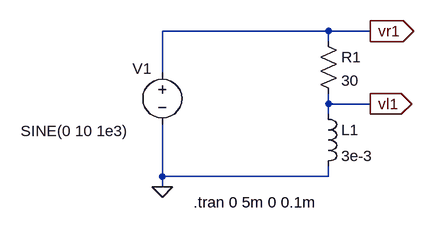
[diagram p0: schematic hw1p1.asc]
hw1p1.asc, the LTspice schematic file:
Version 4
SHEET 1 880 680
WIRE 368 32 112 32
WIRE 432 32 368 32
WIRE 368 48 368 32
WIRE 112 96 112 32
WIRE 368 144 368 128
WIRE 432 144 368 144
WIRE 368 160 368 144
WIRE 112 256 112 176
WIRE 368 256 368 240
WIRE 368 256 112 256
WIRE 112 272 112 256
FLAG 112 272 0
FLAG 432 32 vr1
IOPIN 432 32 Out
FLAG 432 144 vl1
IOPIN 432 144 Out
SYMBOL voltage 112 80 R0
WINDOW 0 -46 10 Left 2
WINDOW 3 -218 106 Left 2
WINDOW 123 0 0 Left 2
WINDOW 39 0 0 Left 2
SYMATTR InstName V1
SYMATTR Value SINE(0 10 1e3)
SYMBOL res 352 32 R0
SYMATTR InstName R1
SYMATTR Value 30
SYMBOL ind 352 144 R0
SYMATTR InstName L1
SYMATTR Value 3e-3
TEXT 160 296 Left 2 !.tran 0 5m 0 0.1m

The netlist it stands for:
* hw1p1.asc
V1 vr1 0 SINE(0 10 1e3)
R1 vr1 vl1 30
L1 vl1 0 3e-3
.tran 0 5m 0 0.1m
.backanno
.end